# Altium schematic sheet 51.SchDoc
size A3
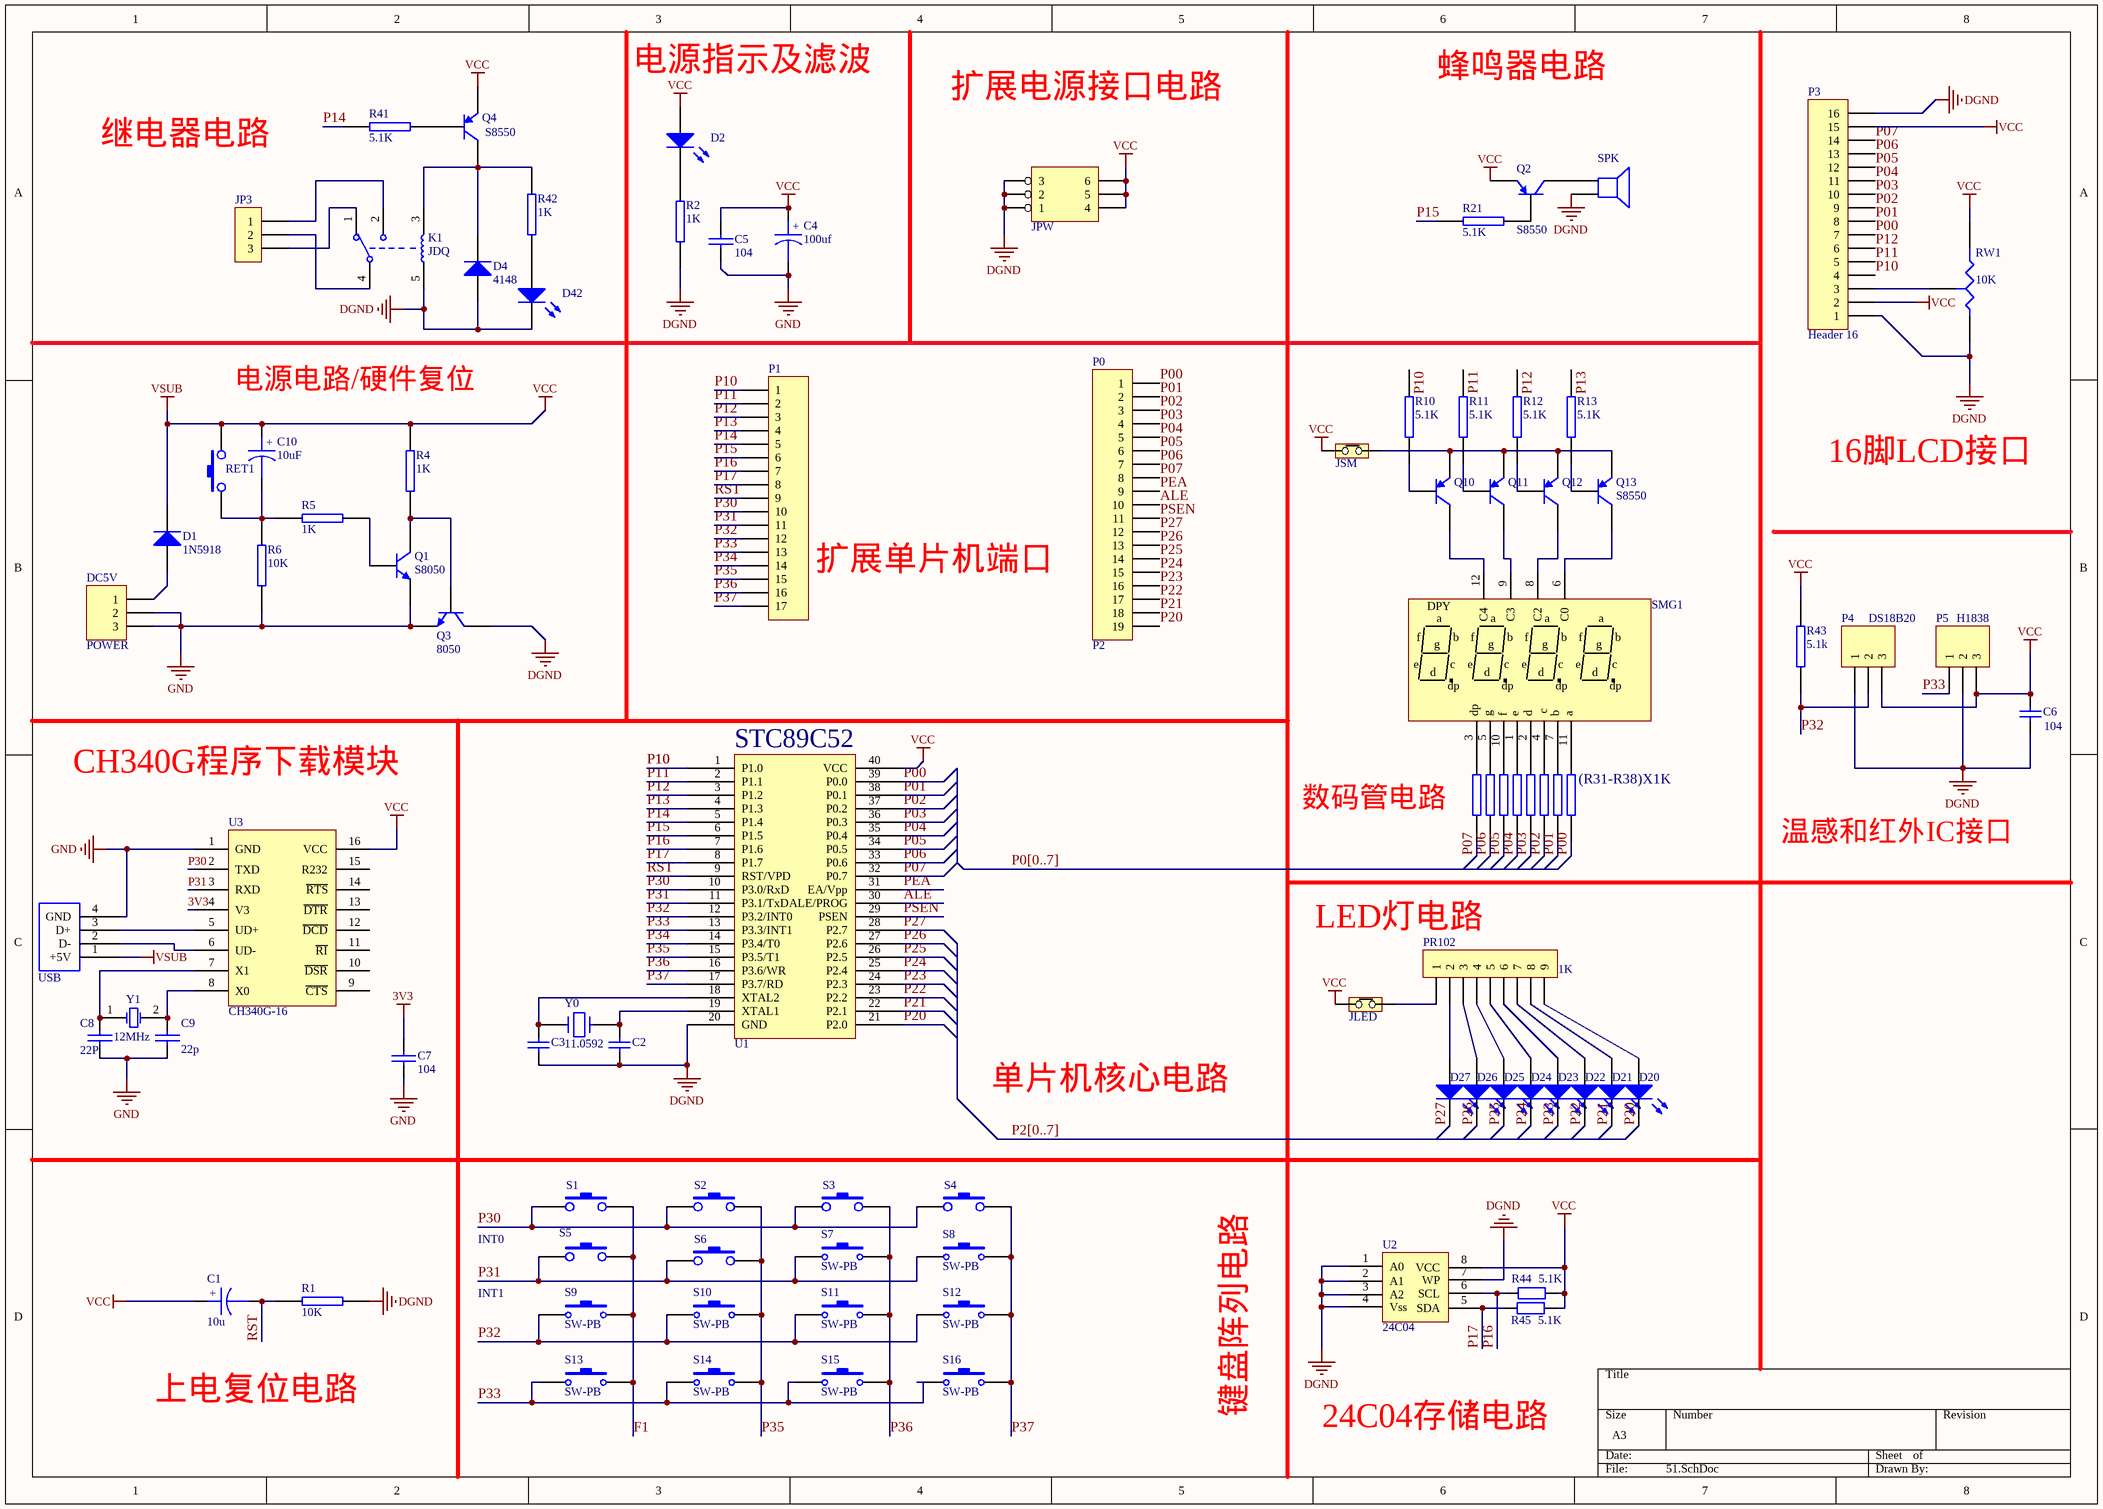
[diagram p0: 51.SchDoc]

## Parts
C1  10u  [C2]
C2  Cap  [RAD-0.1]  (value not drawn)
C3  Cap  [RAD-0.1]  (value not drawn)
C4  100uf  [c4]
C5  104  [RAD-0.1]
C6  value 104  [RAD-0.1]  (hidden comment: Cap)
C7  104  [RAD-0.1]
C8  22P  [RAD-0.1]
C9  22p  [RAD-0.1]
C10  10uF  [c4]
D1  1N5918  [4148]
D2  LED0  [LED2]  (value not drawn)
D4  4148  [DO-41]
D20  LED0  [LED8]  (value not drawn)
D21  LED0  [LED8]  (value not drawn)
D22  LED0  [LED8]  (value not drawn)
D23  LED0  [LED8]  (value not drawn)
D24  LED0  [LED8]  (value not drawn)
D25  LED0  [LED8]  (value not drawn)
D26  LED0  [LED8]  (value not drawn)
D27  LED0  [LED8]  (value not drawn)
D42  LED0  [LED2]  (value not drawn)
DC5V  POWER  [DC5V-3]
JLED  JJ  [j2]  (value not drawn)
JP3  JP3  [JP3]  (value not drawn)
JPW  JPW  [SIP]  (value not drawn)
JSM  JJ  [j2]  (value not drawn)
K1  JDQ  [JDQ]
P0  P2  [j19]
P1  Header 17  [j17]  (value not drawn)
P3  Header 16  [HDR1X16]
P4  DS18B20  [HDR1X3]
P5  H1838  [HDR1X3]
PR102  1K  [SIP-9]
Q1  S8050  [sanjiguan]
Q2  S8550  [sanjiguan]
Q3  8050  [sanjiguan]
Q4  S8550  [sanjiguan]
Q10  S8550  [sanjiguan]  (value not drawn)
Q11  S8550  [sanjiguan]  (value not drawn)
Q12  S8550  [sanjiguan]  (value not drawn)
Q13  S8550  [sanjiguan]
R1  10K  [axial0.4]
R2  1K  [axial0.4]
R4  1K  [axial0.4]
R5  1K  [axial0.4]
R6  10K  [axial0.4]
R10  5.1K  [axial0.4]
R11  5.1K  [axial0.4]
R12  5.1K  [axial0.4]
R13  5.1K  [axial0.4]
R21  5.1K  [axial0.4]
R31  1K  [axial0.4]  (value not drawn)
R32  1K  [axial0.4]  (value not drawn)
R33  1K  [axial0.4]  (value not drawn)
R34  1K  [axial0.4]  (value not drawn)
R35  1K  [axial0.4]  (value not drawn)
R36  1K  [axial0.4]  (value not drawn)
R37  1K  [axial0.4]  (value not drawn)
R38  1K  [axial0.4]  (value not drawn)
R41  5.1K  [axial0.4]
R42  1K  [axial0.4]
R43  5.1k  [axial0.4]
R44  5.1K  [AXIAL-0.4]
R45  5.1K  [AXIAL-0.4]
RET1  RET  [sw]  (value not drawn)
RW1  value 10K  [RW]  (hidden comment: Res Tap)
S1  RET  [sw]  (value not drawn)
S2  RET  [sw]  (value not drawn)
S3  RET  [sw]  (value not drawn)
S4  RET  [sw]  (value not drawn)
S5  RET  [sw]  (value not drawn)
S6  RET  [sw]  (value not drawn)
S7  SW-PB  [SW]
S8  SW-PB  [SW]
S9  SW-PB  [SW]
S10  SW-PB  [SW]
S11  SW-PB  [SW]
S12  SW-PB  [SW]
S13  SW-PB  [SW]
S14  SW-PB  [SW]
S15  SW-PB  [SW]
S16  SW-PB  [SW]
SMG1  SMG  [smg]  (value not drawn)
SPK  Speaker  [HDR1X4]  (value not drawn)
STC89C52  U1  [S52]
U2  24C04  [DIP8]
U3  CH340G-16  [SOP-16 - duplicate]
USB  CON4  [USB]  (value not drawn)
Y0  11.0592  [XTAL1]
Y1  12MHz  [XTAL1]

## Nets
3V3: C7.1 U3.4(V3)
DGND: C2.1 C3.1 C6.1 D4.1(A) D42.2(K) JPW.1 JPW.2 JPW.3 K1.5 P3.1 P3.16 P4.1 P5.2 Q3.3(C) R1.1 R2.1 RW1.1(A) SPK.2(K) STC89C52.20(GND) U2.1(A0) U2.2(A1) U2.3(A2) U2.4(Vss) U2.7(WP)
GND: C4.2 C5.2 C7.2 C8.2 C9.2 DC5V.2 DC5V.3 Q1.1(E) Q3.1(E) R6.2 U3.1(GND) USB.4(GND)
VCC: C1.1 C4.1 C5.1 C6.2 C10.1 D1.2(K) D2.1(A) JLED.1 JPW.4 JPW.5 JPW.6 JSM.1 P3.2 P3.15 P4.3 P5.3 Q2.1(E) Q4.1(E) R4.2 R43.2 R44.2 R45.2 RET1.2 RW1.2(B) STC89C52.40(VCC) U2.8(VCC) U3.16(VCC) USB.1(+5V)  [also labelled VSUB]
ALE: P0.10 STC89C52.30(ALE/PROG)
F1: S1.2 S5.2 S9.2 S13.2
P00: P0.1 P3.7 R31.1 STC89C52.39(P0.0)
P01: P0.2 P3.8 R32.1 STC89C52.38(P0.1)
P02: P0.3 P3.9 R33.1 STC89C52.37(P0.2)
P03: P0.4 P3.10 R34.1 STC89C52.36(P0.3)
P04: P0.5 P3.11 R35.1 STC89C52.35(P0.4)
P05: P0.6 P3.12 R36.1 STC89C52.34(P0.5)
P06: P0.7 P3.13 R37.1 STC89C52.33(P0.6)
P07: P0.8 P3.14 R38.1 STC89C52.32(P0.7)
P10: P1.1 P3.4 R10.2 STC89C52.1(P1.0)
P11: P1.2 P3.5 R11.2 STC89C52.2(P1.1)
P12: P1.3 P3.6 R12.2 STC89C52.3(P1.2)
P13: P1.4 R13.2 STC89C52.4(P1.3)
P14: P1.5 R41.1 STC89C52.5(P1.4)
P15: P1.6 R21.1 STC89C52.6(P1.5)
P16: P1.7 R44.1 STC89C52.7(P1.6) U2.6(SCL)
P17: P1.8 R45.1 STC89C52.8(P1.7) U2.5(SDA)
P20: D20.2(K) P0.19 STC89C52.21(P2.0)
P21: D21.2(K) P0.18 STC89C52.22(P2.1)
P22: D22.2(K) P0.17 STC89C52.23(P2.2)
P23: D23.2(K) P0.16 STC89C52.24(P2.3)
P24: D24.2(K) P0.15 STC89C52.25(P2.4)
P25: D25.2(K) P0.14 STC89C52.26(P2.5)
P26: D26.2(K) P0.13 STC89C52.27(P2.6)
P27: D27.2(K) P0.12 STC89C52.28(P2.7)
P30: P1.10 S1.1 S2.1 S3.1 S4.1 STC89C52.10(P3.0/RxD) U3.2(TXD)
P31: P1.11 S5.1 S6.1 S7.1 S8.1 STC89C52.11(P3.1/TxD) U3.3(RXD)
P32: P1.12 P4.2 R43.1 S9.1 S10.1 S11.1 S12.1 STC89C52.12(P3.2/INT0)
P33: P1.13 P5.1 S13.1 S14.1 S15.1 S16.1 STC89C52.13(P3.3/INT1)
P34: P1.14 STC89C52.14(P3.4/T0)
P35: P1.15 S2.2 S6.2 S10.2 S14.2 STC89C52.15(P3.5/T1)
P36: P1.16 S3.2 S7.2 S11.2 S15.2 STC89C52.16(P3.6/WR)
P37: P1.17 S4.2 S8.2 S12.2 S16.2 STC89C52.17(P3.7/RD)
PEA: P0.9 STC89C52.31(EA/Vpp)
PSEN: P0.11 STC89C52.29(PSEN)
RST: C1.2 P1.9 R1.2 STC89C52.9(RST/VPD)
NetC2_2: C2.2 STC89C52.19(XTAL1) Y0.1
NetC3_2: C3.2 STC89C52.18(XTAL2) Y0.2
NetC8_1: C8.1 U3.7(X1) Y1.1(OSC1)
NetC9_1: C9.1 U3.8(X0) Y1.2(OSC2)
NetC10_2: C10.2 R5.1 R6.1 RET1.1
NetD1_1: D1.1(A) DC5V.1
NetD2_2: D2.2(K) R2.2
NetD4_2: D4.2(K) K1.3 Q4.3(C) R42.2
NetD20_1: D20.1(A) PR102.9
NetD21_1: D21.1(A) PR102.8
NetD22_1: D22.1(A) PR102.7
NetD23_1: D23.1(A) PR102.6
NetD24_1: D24.1(A) PR102.5
NetD25_1: D25.1(A) PR102.4
NetD26_1: D26.1(A) PR102.3
NetD27_1: D27.1(A) PR102.2
NetD42_1: D42.1(A) R42.1
NetJLED_2: JLED.2 PR102.1
NetJP3_1: JP3.1 K1.2
NetJP3_2: JP3.2 K1.4
NetJP3_3: JP3.3 K1.1
NetJSM_2: JSM.2 Q10.1(E) Q11.1(E) Q12.1(E) Q13.1(E)
NetP3_3: P3.3 RW1.3(TAP)
NetQ1_2: Q1.2(B) R5.2
NetQ1_3: Q1.3(C) Q3.2(B) R4.1
NetQ2_2: Q2.2(B) R21.2
NetQ2_3: Q2.3(C) SPK.1(A)
NetQ4_2: Q4.2(B) R41.2
NetQ10_2: Q10.2(B) R10.1
NetQ10_3: Q10.3(C) SMG1.12(C4)
NetQ11_2: Q11.2(B) R11.1
NetQ11_3: Q11.3(C) SMG1.9(C3)
NetQ12_2: Q12.2(B) R12.1
NetQ12_3: Q12.3(C) SMG1.8(C2)
NetQ13_2: Q13.2(B) R13.1
NetQ13_3: Q13.3(C) SMG1.6(C0)
NetR31_2: R31.2 SMG1.11(a)
NetR32_2: R32.2 SMG1.7(b)
NetR33_2: R33.2 SMG1.4(c)
NetR34_2: R34.2 SMG1.2(d)
NetR35_2: R35.2 SMG1.1(e)
NetR36_2: R36.2 SMG1.10(f)
NetR37_2: R37.2 SMG1.5(g)
NetR38_2: R38.2 SMG1.3(dp)
NetU3_5: U3.5(UD+) USB.3(D+)
NetU3_6: U3.6(UD-) USB.2(D-)

Not connected (* = marked no-connect by the designer): U3 9(~{CTS}) 10(~{DSR}) 11(~{RI}) 12(~{DCD}) 13(~{DTR}) 14(~{RTS}) 15(R232)

## Buses and harness runs
bus P0[0..7]
bus P2[0..7]

## Notes on the sheet
- 电源指示及滤波
- 扩展电源接口电路
- 蜂鸣器电路
- 继电器电路
- 电源电路/硬件复位
- 16脚LCD接口
- (near P1) 扩展单片机端口
- CH340G程序下载模块
- (near R31) (R31-R38)X1K
- 数码管电路
- 温感和红外IC接口
- LED灯电路
- 单片机核心电路
- INT0
- INT1
- 键盘阵列电路
- 上电复位电路
- 24C04存储电路
- (in symbol CAPACITOR POL) +
- (in symbol SMG) DPY

## Library data of the parts
C1 C4 C10 = CAPACITOR POL: Capacitor
C2 C3 = Cap: Capacitor; Manufacturer: Generic Components; Class: Passive; Value: 0.1uF; Published: 08/06/2000; Publisher: Altium Hobart Technology Centre; SubClass: Capacitor
C5 = CAP: Capacitor
C6-C9 = Cap: Capacitor
  C6: Published: 8-Jun-2000; LatestRevisionDate: 17-Jul-2002; LatestRevisionNote: Re-released for DXP Platform.; PackageReference: RAD-0.3; Publisher: Altium Limited
D1 = Diode 1N5408: 3 Amp Medium Power Silicon Rectifier Diode; Published: 8-Jun-2000; LatestRevisionDate: 17-Jul-2002; LatestRevisionNote: Re-released for DXP Platform.; DatasheetDocument: Aug-1984; PackageReference: DO-201AD; Publisher: Altium Limited; ComponentLink1Description: Manufacturer Link; ComponentLink1URL: http://www.irf.com/
D2 D20-D27 D42 = LED0: Typical INFRARED GaAs LED; Published: 8-Jun-2000; LatestRevisionDate: 08-Jul-2005; LatestRevisionNote: Mech Layer 1 removed.; PackageReference: LED-0; Publisher: Altium Limited
D4 = Diode 1N4001: 1 Amp General Purpose Rectifier; Published: 8-Jun-2000; LatestRevisionDate: 17-Jul-2002; LatestRevisionNote: Re-released for DXP Platform.; DatasheetDocument: 1998; PackageDocument: Aug-1999; PackageReference: DO-41; Publisher: Altium Limited; Code_JEDEC: DO-204-AL; ComponentLink1Description: Manufacturer Link; ComponentLink1URL: http://www.fairchildsemi.com/; ComponentLink2Description: Datasheet; ComponentLink2URL: http://www.fairchildsemi.com/ds/1N%2F1N4001.pdf
DC5V P4 P5 = Header 3: Header, 3-Pin; LatestRevisionDate: 17-Jul-2002; LatestRevisionNote: Re-released for DXP Platform.; Publisher: Altium Limited
P0 = Header 19: Header, 19-Pin; LatestRevisionDate: 17-Jul-2002; LatestRevisionNote: Re-released for DXP Platform.; Publisher: Altium Limited
P1 = Header 17: Header, 17-Pin; LatestRevisionDate: 17-Jul-2002; LatestRevisionNote: Re-released for DXP Platform.; Publisher: Altium Limited
P3 = Header 16: Header, 16-Pin; LatestRevisionDate: 17-Jul-2002; LatestRevisionNote: Re-released for DXP Platform.; Publisher: Altium Limited
PR102 = CON9: Connector
Q1 Q3 = 2N3904: NPN General Purpose Amplifier; Published: 8-Jun-2000; LatestRevisionDate: 15-Jan-2003; LatestRevisionNote: PCB Footprint 'BCY-W3/D4.7' replaced; DatasheetVersion: 1997; PackageVersion: Sep-1998; PackageReference: TO-92A; Publisher: Altium Limited; PackageDescription: TO, Flat Index; 3 In-Line, Axial Leads; Body Dia. 4.5mm; Leads 0.51 x 0.48 mm (max); ComponentLink1Description: Manufacturer Link; ComponentLink1URL: http://www.fairchildsemi.com/; ComponentLink2Description: Datasheet; ComponentLink2URL: http://www.fairchildsemi.com/ds/2N%2F2N3904.pdf
Q2 Q4 Q10-Q13 = 2N3906: PNP General Purpose Amplifier; Published: 8-Jun-2000; LatestRevisionDate: 15-Jan-2003; LatestRevisionNote: PCB Footprint 'BCY-W3/D4.7' replaced; DatasheetDocument: 1997; PackageDocument: Sep-1998; PackageReference: TO-92A; Publisher: Altium Limited; Code_JEDEC: TO-92A; ComponentLink1Description: Manufacturer Link; ComponentLink1URL: http://www.fairchildsemi.com/; ComponentLink2Description: Datasheet; ComponentLink2URL: http://www.fairchildsemi.com/ds/2N%2F2N3906.pdf
R1 R4-R6 R10-R13 R21 R31-R38 R41-R43 = Res2
R2 = RES2
R44 R45 = Res2: Resistor; Published: 8-Jun-2000; LatestRevisionDate: 17-Jul-2002; LatestRevisionNote: Re-released for DXP Platform.; PackageReference: AXIAL-0.4; Publisher: Altium Limited; Value: 5.1K
RET1 S1-S6 = SW-PB
RW1 = Res Tap: Tapped Resistor; Sim Note: Enter the Resistance value and the set point into parameter fields.; Set Position: 0.5; Published: 24-Mar-1999; LatestRevisionDate: 17-Jul-2002; LatestRevisionNote: Re-released for DXP Platform.; PackageReference: VR3; Publisher: Altium Limited
S7-S16 = SW-PB: Switch; Published: 24-Mar-1999; LatestRevisionDate: 17-Jul-2002; LatestRevisionNote: Re-released for DXP Platform.; PackageReference: SPST-2; Publisher: Altium Limited
STC89C52 = 89C51
USB = CON4: Connector
Y0 = CRYSTAL
Y1 = XTAL: Crystal Oscillator; Published: 8-Jun-2000; LatestRevisionDate: 17-Jul-2002; LatestRevisionNote: Re-released for DXP Platform.; PackageReference: R38; Publisher: Altium Limited